# Altium schematic sheet INPUT_POWER.SchDoc
size B; SheetNumber: 3; SheetTotal: 5
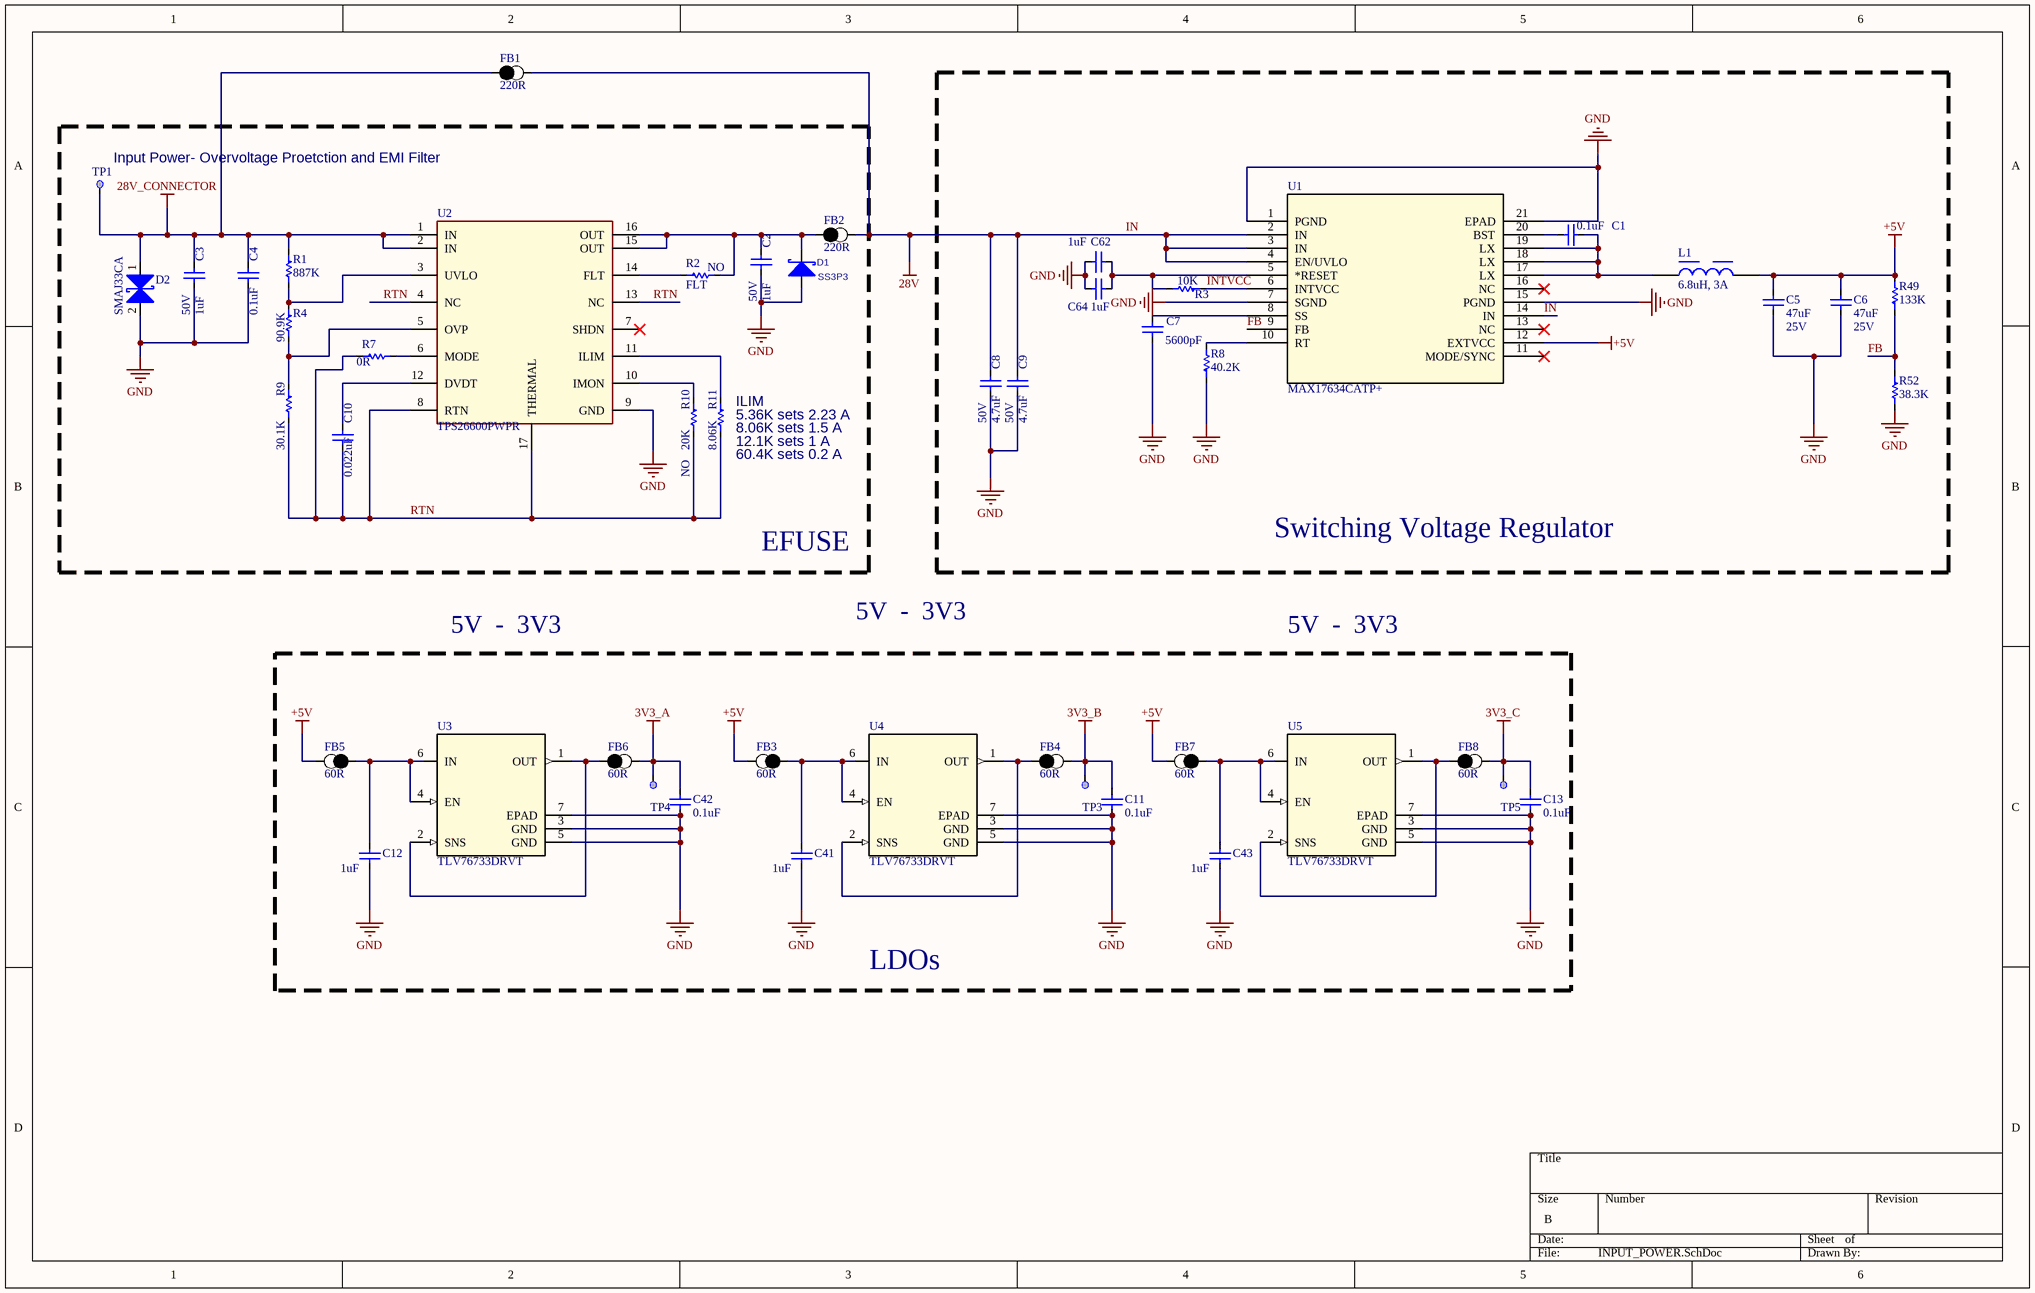
[diagram p0: INPUT_POWER.SchDoc]

## Parts
C1  0.1uF  [CAPC1005-0402X55N]
C2  1uF  VOLTAGE: 50V  [CAPC2012-0805X80N]
C3  1uF  VOLTAGE: 50V  [CAPC2012-0805X80N]
C4  0.1uF  [CAPC2012-0805X110N]
C5  47uF  VOLTAGE: 25V  [CAPC2012-0805X150N]
C6  47uF  VOLTAGE: 25V  [CAPC2012-0805X150N]
C7  5600pF  [CAPC1005-0402X55N]
C8  4.7uF  VOLTAGE: 50V  [CAPC2012-0805X80N]
C9  4.7uF  VOLTAGE: 50V  [CAPC2012-0805X80N]
C10  0.022uF  [CAPC1608-0603X90N]
C11  0.1uF  [CAPC1608-0603X90N]
C12  1uF  [CAPC1608-0603X90N]
C13  0.1uF  [CAPC1608-0603X90N]
C41  1uF  [CAPC1608-0603X90N]
C42  0.1uF  [CAPC1608-0603X90N]
C43  1uF  [CAPC1608-0603X90N]
C62  1uF  [CAPC1608-0603X90N]
C64  1uF  [CAPC1608-0603X90N]
D1  SS3P3  [DO-220AA (SMP)]
D2  SMAJ33CA  [DO-214AC]
FB1  220R  [INDC2012-0805X90N]
FB2  220R  [INDC2012-0805X90N]
FB3  60R  [INDC1608-0603X80N]
FB4  60R  [INDC1608-0603X80N]
FB5  60R  [INDC1608-0603X80N]
FB6  60R  [INDC1608-0603X80N]
FB7  60R  [INDC1608-0603X80N]
FB8  60R  [INDC1608-0603X80N]
L1  6.8uH, 3A  [WE-MAIA_4030]
R1  887K  [RESC1608-0603X50N]
R2  FLT  POPULATED: NO  [RESC1608-0603X50N]
R3  10K  [RESC1005-0402X35N]
R4  90.9K  [RESC1608-0603X50N]
R7  0R  [RESC1608-0603X50N]
R8  40.2K  [RESC1608-0603X50N]
R9  30.1K  [RESC1608-0603X50N]
R10  20K  POPULATED: NO  [RESC1608-0603X50N]
R11  8.06K  [RESC1608-0603X50N]
R49  133K  [RESC1608-0603X50N]
R52  38.3K  [RESC1608-0603X50N]
TP1  TP  [TP-OCTAGONAL]  (value not drawn)  (no BOM)
TP3  TP  [TP-OCTAGONAL]  (value not drawn)  (no BOM)
TP4  TP  [TP-OCTAGONAL]  (value not drawn)  (no BOM)
TP5  TP  [TP-OCTAGONAL]  (value not drawn)  (no BOM)
U1  MAX17634CATP+  [max17633]
U2  TPS26600PWPR  [TSSOP65P640-16N-2.74MM T.PAD]
U3  TLV76733DRVT  [SON65P200X200X80-7N]
U4  TLV76733DRVT  [SON65P200X200X80-7N]
U5  TLV76733DRVT  [SON65P200X200X80-7N]

## Blocks framed on the sheet
EFUSE: C2-C4 C10 D1 D2 FB2 R1 R2 R4 R7 R9-R11 TP1 U2
Switching Voltage Regulator: C1 C5-C9 C62 C64 L1 R3 R8 R49 R52 U1
LDOs: C11-C13 C41-C43 FB3-FB8 TP3-TP5 U3-U5

## Nets
3V3_A: C42.2 FB6.2 TP4.1
3V3_B: C11.2 FB4.2 TP3.1
3V3_C: C13.2 FB8.2 TP5.1
28V_CONNECTOR: C3.1 C4.2 D2.1(K) FB1.1 R1.1 TP1.1 U2.1(IN) U2.2(IN)
+5V: C5.2 C6.2 FB3.2 FB5.2 FB7.2 L1.2 R49.2 U1.12(EXTVCC)
GND: C2.2 C3.2 C4.1 C5.1 C6.1 C7.1 C8.2 C9.2 C11.1 C12.1 C13.1 C41.1 C42.1 C43.1 C62.2 C64.2 D1.2 D2.2(A) R8.1 R52.2 U1.1(PGND) U1.7(SGND) U1.15(PGND) U1.21(EPAD) U2.9(GND) U3.3(GND) U3.5(GND) U3.7(EPAD) U4.3(GND) U4.5(GND) U4.7(EPAD) U5.3(GND) U5.5(GND) U5.7(EPAD)
IN: C8.1 C9.1 FB1.2 FB2.2 U1.2(IN) U1.3(IN) U1.4(EN/UVLO) U1.14(IN)  [also labelled 28V]
FB: R49.1 R52.1 U1.9(FB)
INTVCC: R3.1 U1.6(INTVCC)
RTN: C10.1 R7.1 R9.2 R10.2 R11.2 U2.4(NC) U2.8(RTN) U2.13(NC) U2.17(THERMAL)
NetC1_1: C1.1 U1.20(BST)
NetC1_2: C1.2 L1.1 U1.17(LX) U1.18(LX) U1.19(LX)
NetC2_1: C2.1 D1.1 FB2.1 R2.2 U2.15(OUT) U2.16(OUT)
NetC7_2: C7.2 U1.8(SS)
NetC10_2: C10.2 U2.12(DVDT)
NetC12_2: C12.2 FB5.1 U3.4(EN) U3.6(IN)
NetC41_2: C41.2 FB3.1 U4.4(EN) U4.6(IN)
NetC43_2: C43.2 FB7.1 U5.4(EN) U5.6(IN)
NetC62_1: C62.1 C64.1 R3.2 U1.5(*RESET)
NetFB4_1: FB4.1 U4.1(OUT) U4.2(SNS)
NetFB6_1: FB6.1 U3.1(OUT) U3.2(SNS)
NetFB8_1: FB8.1 U5.1(OUT) U5.2(SNS)
NetR1_2: R1.2 R4.1 U2.3(UVLO)
NetR2_1: R2.1 U2.14(FLT)
NetR4_2: R4.2 R9.1 U2.5(OVP)
NetR7_2: R7.2 U2.6(MODE)
NetR8_2: R8.2 U1.10(RT)
NetR10_1: R10.1 U2.10(IMON)
NetR11_1: R11.1 U2.11(ILIM)

Not connected (* = marked no-connect by the designer): U1 11(MODE/SYNC)* 13(NC)* 16(NC)*; U2 7(SHDN)*

## Notes on the sheet
- (near TP1) Input Power- Overvoltage Proetction and EMI Filter
- (near R11) 5.36K sets 2.23 A
- (near R11) 8.06K sets 1.5 A
- (near R11) ILIM
- (near R11) 12.1K sets 1 A
- (near R11) 60.4K sets 0.2 A
- 5V  -  3V3

## Library data of the parts
C1 = CAP 0.1uF_0402: CAP CER 0.1UF 16V X7R 0402; MANUFACTURER PN: CC0402KRX7R7BB104; MANUFACTURER: Samsung Electro-Mechanics; POPULATED: YES; TOLERANCE: 10%; ANTSIS STOK PN: C0U14021016; ASSEMBLY: Auto; VOLTAGE: 16V; PACKAGE: 0402; DIGIKEY PN: ANTSIS_STOK
C2 C3 C8 C9 = Capacitor Ceramic: CAP CER 1UF 50V X5R 0805; MANUFACTURER PN: UMK212BJ105KG-T; MANUFACTURER: Taiyo Yuden; POPULATED: YES; TOLERANCE: -55°C ~ 125°C; PACKAGE: 0805; DIGIKEY PN: 587-2229-1-ND
C4 = Capacitor Ceramic: CAP CER 0.1UF 100V X7R 0805; MANUFACTURER PN: GCM21BR72A104KA37L; MANUFACTURER: Murata Electronics; POPULATED: YES; TOLERANCE: -55°C ~ 125°C; VOLTAGE: 100V; PACKAGE: 0805; DIGIKEY PN: 490-4789-1-ND
C5 C6 = CAP CER 22UF 0805 25V: CAP CER 22UF 25V X5R 0805; MANUFACTURER PN: GRT21BR61E226ME13L; MANUFACTURER: Murata Electronics; POPULATED: YES; TOLERANCE: -55°C ~ 85°C; PACKAGE: 0805; DIGIKEY PN: 490-12389-1-ND
C7 = CAP 10nF_0402: CAP CER 5600PF 25V X7R 0402; MANUFACTURER PN: GRM155R71E562KA01D; MANUFACTURER: Murata Electronics; POPULATED: YES; TOLERANCE: 10%; ASSEMBLY: Auto; VOLTAGE: 25V; PACKAGE: 0402; DIGIKEY PN: ANTSIS_STOK; ANTSIS STOK PN: --
C10 = Capacitor Ceramic: CAP CER 0.022UF 16V X7R 0603; MANUFACTURER PN: CC0603KRX7R7BB223; MANUFACTURER: Yageo; POPULATED: YES; TOLERANCE: -55°C ~ 125°C; VOLTAGE: 16V; PACKAGE: 0805; DIGIKEY PN: 311-1800-1-ND
C11 C13 C42 = CAP 0.1uF: CAP CER 0.1UF 50V X7R 0603; MANUFACTURER PN: CL10B104KB8NNNC; MANUFACTURER: Samsung Electro-Mechanics; POPULATED: YES; TOLERANCE: 10%; ANTSIS STOK PN: C0U106031050; ASSEMBLY: Auto; VOLTAGE: 50V; PACKAGE: 0603; DIGIKEY PN: ANTSIS_STOK
C12 C41 C43 C62 C64 = CAP 1uF: CAP CER 1UF 25V X7R 0603; MANUFACTURER PN: CL10B105KA8NNNC; MANUFACTURER: Samsung Electro-Mechanics; POPULATED: YES; TOLERANCE: 10%; ANTSIS STOK PN: C1U006031050; ASSEMBLY: Auto; VOLTAGE: 25V; PACKAGE: 0603; DIGIKEY PN: ANTSIS_STOK
D1 = D-Vishay-SS3P3-E3/84A-Schottky: DIODE SCHOTTKY 40V 3A DO220AA; MANUFACTURER: Vishay Semiconductor Diodes Division; MANUFACTURER PN: SS3P4-M3/84A; TOLERANCE: -55°C ~ 150°C; POPULATED: YES; DIGIKEY PN: SS3P4-M3/84AGICT-ND; PACKAGE: DO-220AA (SMP); VOLTAGE: 40V
D2 = SMAJ33CA: TVS DIODE 33V 53.3V DO214AC; MANUFACTURER: ON Semiconductor; POPULATED: YES; TOLERANCE: -65°C ~ 150°C (TJ); PACKAGE: DO-214AC, SMA; MANUFACTURER PN: SMAJ33CA; DIGIKEY PN: SMAJ33CALFCT-ND
FB1 FB2 = Inductor EMI suppresion: FERRITE BEAD 220 OHM 0805 1LN; MANUFACTURER: Murata Electronics; MANUFACTURER PN: BLM21PG221SN1D; POPULATED: YES; VOLTAGE: 2A; TOLERANCE: -55°C ~ 125°C; DIGIKEY PN: 490-1054-1-ND; PACKAGE: 0805
FB3-FB8 = FERRITE 60R 3A: FERRITE BEAD 60 OHM 0603 1LN; MANUFACTURER: Würth Elektronik; MANUFACTURER PN: 742792602; POPULATED: YES; TOLERANCE: -55°C ~ 125°C; VOLTAGE: 3A; ANTSIS STOK PN: F60R00603xx03; ASSEMBLY: Auto; DIGIKEY PN: ANTSIS_STOK; PACKAGE: 0603
L1 = 78438357068: WE-MAIA SMT Power Inductor, size 4030, 6.8uH, 3A, 74mOhm; Manufacturer: Wurth Elektronik; Saturation Current: 5.5A; Self Resonant Frequency: 19.5MHz; ComponentLink1Description: Manufacturer; ComponentLink1URL: http://www.we-online.de; ComponentLink2Description: Datasheet; ComponentLink2URL: https://www.we-online.com/catalog/datasheet/78438357068.pdf; Manufacturer Part Number: 78438357068; Published Date: September 2020; Rated Current: 3A; Inductance: 6.8uH; DC Resistance max.: 74mOhm; Operating Temperature: -40 to +125degC; Mounting Technology: SMT; Packaging: Tape and Reel; Size: 4030
R1 = Resistor SMD: RES SMD 887K OHM 1% 1/10W 0603; MANUFACTURER: Vishay Dale; MANUFACTURER PN: CRCW0603887KFKEA; POPULATED: YES; TOLERANCE: -55°C ~ 155°C; DIGIKEY PN: 541-887KHCT-ND; PACKAGE: 0603
R2 = Resistor SMD: RES SMD 12.1K OHM 1% 1/10W 0603; TOLERANCE: -55°C ~ 155°C; PACKAGE: 0603
R3 = RESISTOR 10K_0402: RES SMD 10K OHM 1% 1/10W 0402; MANUFACTURER: Yageo; MANUFACTURER PN: RC0402FR-0710KL; POPULATED: YES; TOLERANCE: 5%; ANTSIS STOK PN: R10K0040205006; ASSEMBLY: Auto; DIGIKEY PN: ANTSIS_STOK; PACKAGE: 0402
R4 = Resistor SMD: RES SMD 90.9K OHM 1% 1/10W 0603; MANUFACTURER: Vishay Dale; MANUFACTURER PN: CRCW060390K9FKEA; POPULATED: YES; TOLERANCE: -55°C ~ 155°C; DIGIKEY PN: 541-90.9KHCT-ND; PACKAGE: 0603
R7 = Resistor SMD: RES SMD 0 OHM JUMPER 1/10W 0603; MANUFACTURER: Yageo; MANUFACTURER PN: RC0603JR-070RL; POPULATED: YES; TOLERANCE: -55°C ~ 155°C; DIGIKEY PN: 311-0.0GRCT-ND; PACKAGE: 0603
R8 = RESISTOR 0R: RES SMD 0 OHM JUMPER 1/10W 0603; MANUFACTURER: Yageo; MANUFACTURER PN: RT0603DRD0710KL; POPULATED: YES; ASSEMBLY: Auto; DIGIKEY PN: 311-10KDDKR-ND; PACKAGE: 0603; ANTSIS STOK PN: --
R9 = Resistor SMD: RES SMD 30.1K OHM 1% 1/10W 0603; MANUFACTURER: Vishay Dale; MANUFACTURER PN: CRCW060330K1FKEA; POPULATED: YES; TOLERANCE: -55°C ~ 155°C; DIGIKEY PN: 541-30.1KHCT-ND; PACKAGE: 0603
R10 = Resistor SMD: RES SMD 20K OHM 1% 1/10W 0603; MANUFACTURER: Vishay Dale; MANUFACTURER PN: CRCW060320K0FKEAC; TOLERANCE: -55°C ~ 155°C; DIGIKEY PN: 541-3987-1-ND; PACKAGE: 0603
R11 = Resistor SMD: RES SMD 8.06 OHM 1% 1/10W 0603; MANUFACTURER: Vishay Dale; MANUFACTURER PN: CRCW06038R06FKEA; POPULATED: YES; TOLERANCE: -55°C ~ 155°C; DIGIKEY PN: 541-8.06HHCT-ND; PACKAGE: 0603
R49 = RESISTOR 143K: RES SMD 133K OHM 1% 1/4W 0603; MANUFACTURER: Vishay Dale; MANUFACTURER PN: RCS0603133KFKEA; POPULATED: YES; ASSEMBLY: Auto; DIGIKEY PN: 541-RCS0603133KFKEADKR-ND; PACKAGE: 0603; TOLERANCE: 1%; ANTSIS STOK PN: --
R52 = RESISTOR 143K: RES 38.3K OHM 1% 1/10W 0603; MANUFACTURER: Stackpole Electronics Inc; MANUFACTURER PN: RMCF0603FT38K3; POPULATED: YES; ASSEMBLY: Auto; DIGIKEY PN: RMCF0603FT38K3CT-ND; PACKAGE: 0603; TOLERANCE: 1%; ANTSIS STOK PN: --
TP1 TP3-TP5 = TP: Test point; ASSEMBLY: Manuel
U1 = MAX17633CATP+: IC REG BUCK ADJ 4.25A; Mfr_Name: Maxim Integrated Products; Copyright: Copyright (C) 2021 Ultra Librarian. All rights reserved.; Manufacturer_Part_Number: MAX17633CATP+; Digi-Key_Part_Number_1: MAX17633CATP+-ND; Type: DEV
U2 = TPS26600: IC PWR MGMT EFUSE 60V 16HTSSOP; MANUFACTURER: Texas Instruments; POPULATED: YES; TOLERANCE: -40°C ~ 125°C (TJ); MANUFACTURER PN: TPS26600PWPR; PACKAGE: HTTSOP-16; DIGIKEY PN: 296-47292-1-ND
U3-U5 = TLV76733DRVT: No Description Available; Mfr_Name: Texas Instruments; Type: DEV; RefDes: RefDes; Copyright: Copyright (C) 2021 Ultra Librarian. All rights reserved.; Manufacturer_Part_Number: TLV76733DRVT; Digi-Key_Part_Number_1: 296-TLV76733DRVTTR-ND; Digi-Key_Part_Number_2: 296-TLV76733DRVTCT-ND; Digi-Key_Part_Number_3: 296-TLV76733DRVTDKR-ND